# EAGLE design Shuttle (EAGLE 8.3.1)
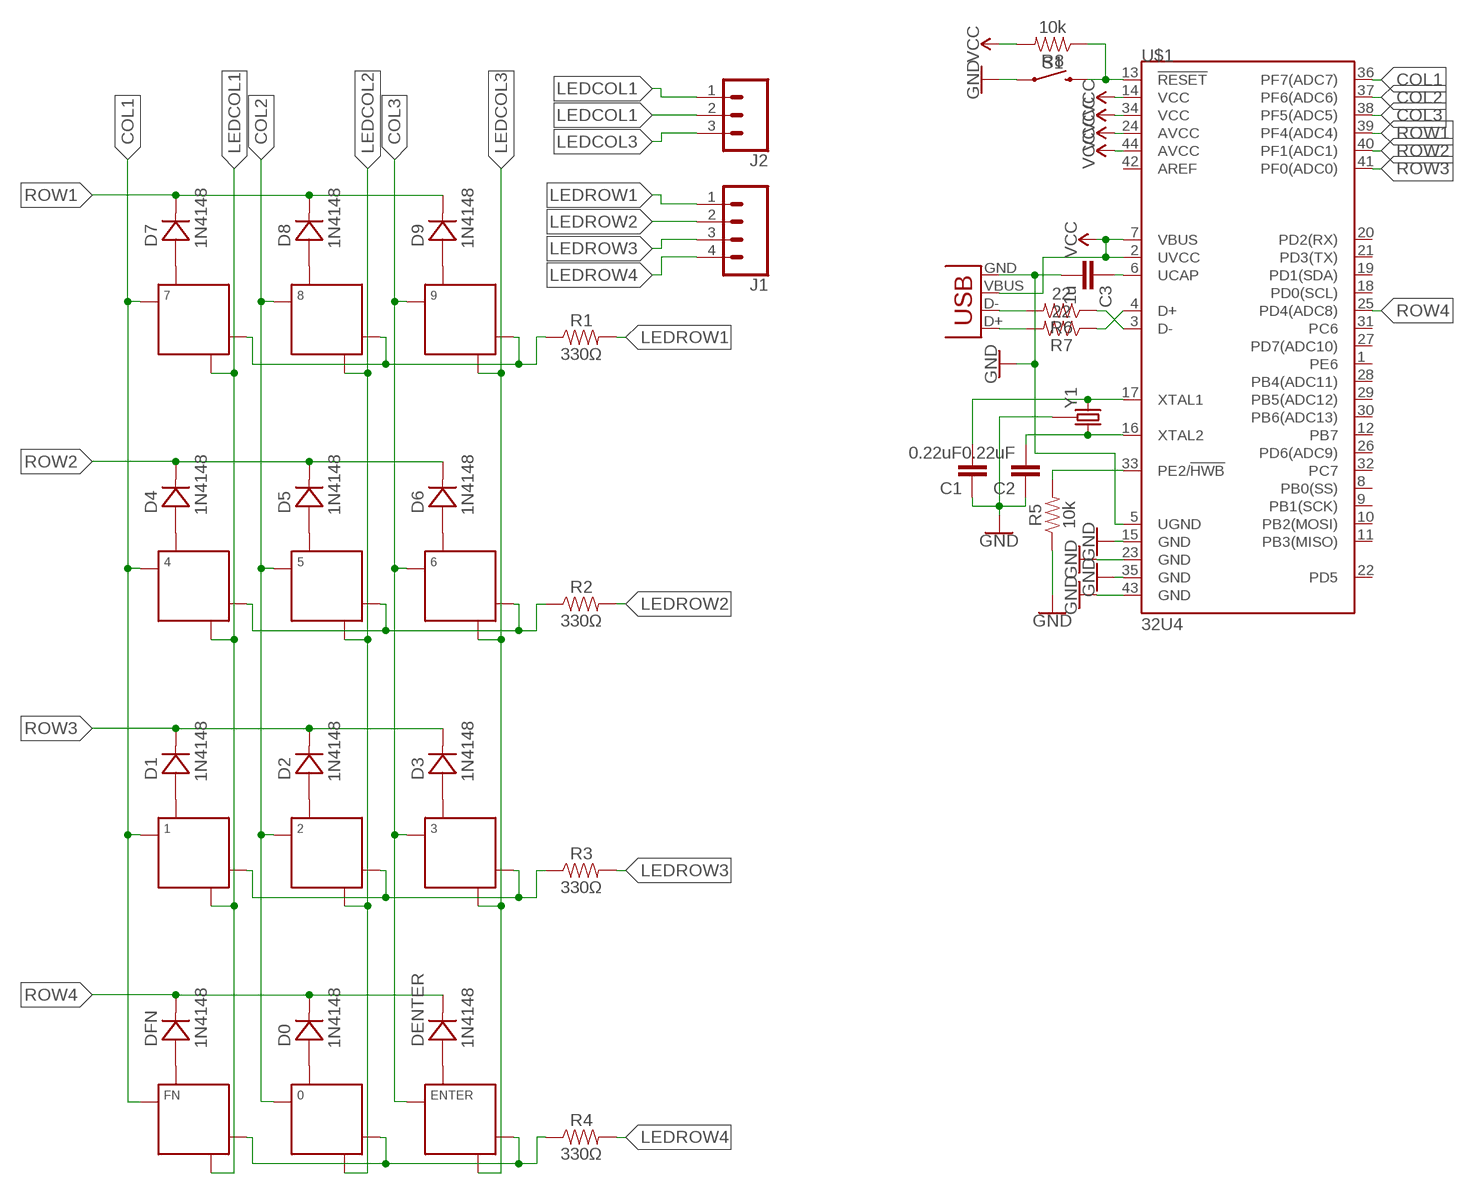
[diagram p0: schematic, sheet 1]

## Parts
0  KEYSWITCH-LED-ALPSMX-1U-LED  [ALPSMX-1U-LED]
1  KEYSWITCH-LED-ALPSMX-1U-LED  [ALPSMX-1U-LED]
2  KEYSWITCH-LED-ALPSMX-1U-LED  [ALPSMX-1U-LED]
3  KEYSWITCH-LED-ALPSMX-1U-LED  [ALPSMX-1U-LED]
4  KEYSWITCH-LED-ALPSMX-1U-LED  [ALPSMX-1U-LED]
5  KEYSWITCH-LED-ALPSMX-1U-LED  [ALPSMX-1U-LED]
6  KEYSWITCH-LED-ALPSMX-1U-LED  [ALPSMX-1U-LED]
7  KEYSWITCH-LED-ALPSMX-1U-LED  [ALPSMX-1U-LED]
8  KEYSWITCH-LED-ALPSMX-1U-LED  [ALPSMX-1U-LED]
9  KEYSWITCH-LED-ALPSMX-1U-LED  [ALPSMX-1U-LED]
C1  0.22uF  0.22UF-0603-25V-10%  [0603]
C2  0.22uF  0.22UF-0603-25V-10%  [0603]
C3  1u  0.22UF-0603-25V-10%  [0603]
D0  1N4148  DIODE-DO-35  [DO-35]
D1  1N4148  DIODE-DO-35  [DO-35]
D2  1N4148  DIODE-DO-35  [DO-35]
D3  1N4148  DIODE-DO-35  [DO-35]
D4  1N4148  DIODE-DO-35  [DO-35]
D5  1N4148  DIODE-DO-35  [DO-35]
D6  1N4148  DIODE-DO-35  [DO-35]
D7  1N4148  DIODE-DO-35  [DO-35]
D8  1N4148  DIODE-DO-35  [DO-35]
D9  1N4148  DIODE-DO-35  [DO-35]
DENTER  1N4148  DIODE-DO-35  [DO-35]
DFN  1N4148  DIODE-DO-35  [DO-35]
ENTER  KEYSWITCH-LED-ALPSMX-1U-LED  [ALPSMX-1U-LED]
FN  KEYSWITCH-LED-ALPSMX-1U-LED  [ALPSMX-1U-LED]
J1  CONN_04  [1X04]
J2  CONN_03  [1X03]
R1  330Ω  RESISTORAXIAL-0.3  [AXIAL-0.3]
R2  330Ω  RESISTORAXIAL-0.3  [AXIAL-0.3]
R3  330Ω  RESISTORAXIAL-0.3  [AXIAL-0.3]
R4  330Ω  RESISTORAXIAL-0.3  [AXIAL-0.3]
R5  10k  RESISTORAXIAL-0.3  [AXIAL-0.3]
R6  22  RESISTORAXIAL-0.3  [AXIAL-0.3]
R7  22  RESISTORAXIAL-0.3  [AXIAL-0.3]
R8  10k  RESISTORAXIAL-0.3  [AXIAL-0.3]
S1  MOMENTARY-SWITCH-SPST-PTH-6.0MM  [TACTILE_SWITCH_PTH_6.0MM]
U$1  32U4  ATMEGA32U4TQFP-44  [TQFP44]
X1  USB-MB-H  [USB-MB-H]
Y1  CRYSTAL-GROUNDEDSMD-5X3.2  [CRYSTAL-SMD-5X3.2-4PAD]

## Nets
COL1: 1.ALPS1(P0) 1.MX1(P0) 4.ALPS1(P0) 4.MX1(P0) 7.ALPS1(P0) 7.MX1(P0) FN.ALPS1(P0) FN.MX1(P0) U$1.36(PF7(ADC7))
COL2: 0.ALPS1(P0) 0.MX1(P0) 2.ALPS1(P0) 2.MX1(P0) 5.ALPS1(P0) 5.MX1(P0) 8.ALPS1(P0) 8.MX1(P0) U$1.37(PF6(ADC6))
COL3: 3.ALPS1(P0) 3.MX1(P0) 6.ALPS1(P0) 6.MX1(P0) 9.ALPS1(P0) 9.MX1(P0) ENTER.ALPS1(P0) ENTER.MX1(P0) U$1.38(PF5(ADC5))
GND: C1.1 C2.1 C3.2 R5.P$1 S1.1 U$1.5(UGND) U$1.15(GND) U$1.23(GND) U$1.35(GND) U$1.43(GND) X1.GND Y1.2 Y1.4
LEDCOL1: 1.LED+ 4.LED+ 7.LED+ FN.LED+ J2.1 J2.2
LEDCOL2: 0.LED+ 2.LED+ 5.LED+ 8.LED+
LEDCOL3: 3.LED+ 6.LED+ 9.LED+ ENTER.LED+ J2.3
LEDROW1: J1.1 R1.P$2
LEDROW2: J1.2 R2.P$2
LEDROW3: J1.3 R3.P$2
LEDROW4: J1.4 R4.P$2
N$1: 7.ALPS2(P1) 7.MX2(P1) D7.A
N$2: 8.ALPS2(P1) 8.MX2(P1) D8.A
N$3: 9.ALPS2(P1) 9.MX2(P1) D9.A
N$4: 4.ALPS2(P1) 4.MX2(P1) D4.A
N$5: 5.ALPS2(P1) 5.MX2(P1) D5.A
N$6: 6.ALPS2(P1) 6.MX2(P1) D6.A
N$7: 1.ALPS2(P1) 1.MX2(P1) D1.A
N$8: 2.ALPS2(P1) 2.MX2(P1) D2.A
N$9: 3.ALPS2(P1) 3.MX2(P1) D3.A
N$10: DFN.A FN.ALPS2(P1) FN.MX2(P1)
N$11: 0.ALPS2(P1) 0.MX2(P1) D0.A
N$12: DENTER.A ENTER.ALPS2(P1) ENTER.MX2(P1)
N$13: C2.2 U$1.16(XTAL2) Y1.1
N$14: 7.LED- 8.LED- 9.LED- R1.P$1
N$15: R7.P$2 X1.D+
N$16: R7.P$1 U$1.4(D+)
N$17: C1.2 U$1.17(XTAL1) Y1.3
N$18: 4.LED- 5.LED- 6.LED- R2.P$1
N$19: R5.P$2 U$1.33(PE2/!HWB)
N$20: R6.P$2 X1.D-
N$21: R6.P$1 U$1.3(D-)
N$23: C3.1 U$1.6(UCAP)
N$25: R8.P$1 S1.3 U$1.13(!RESET)
N$27: 1.LED- 2.LED- 3.LED- R3.P$1
N$28: 0.LED- ENTER.LED- FN.LED- R4.P$1
ROW1: D7.C D8.C D9.C U$1.39(PF4(ADC4))
ROW2: D4.C D5.C D6.C U$1.40(PF1(ADC1))
ROW3: D1.C D2.C D3.C U$1.41(PF0(ADC0))
ROW4: D0.C DENTER.C DFN.C U$1.25(PD4(ADC8))
VCC: R8.P$2 U$1.2(UVCC) U$1.7(VBUS) U$1.14(VCC) U$1.24(AVCC) U$1.34(VCC) U$1.44(AVCC) X1.VBUS
Unconnected: U$1.1(PE6) U$1.8(PB0(SS)) U$1.9(PB1(SCK)) U$1.10(PB2(MOSI)) U$1.11(PB3(MISO)) U$1.12(PB7) U$1.18(PD0(SCL)) U$1.19(PD1(SDA)) U$1.20(PD2(RX)) U$1.21(PD3(TX)) U$1.22(PD5) U$1.26(PD6(ADC9)) U$1.27(PD7(ADC10)) U$1.28(PB4(ADC11)) U$1.29(PB5(ADC12)) U$1.30(PB6(ADC13)) U$1.31(PC6) U$1.32(PC7) U$1.42(AREF)

## Library data of the parts
0 1-9 ENTER FN = Keyboard:KEYSWITCH-LED
C1 C2 = SparkFun-Capacitors:0.22UF: 0.22µF ceramic capacitors A capacitor is a passive two-terminal electrical component used to store electrical energy temporarily in an electric field.; PROD_ID: CAP-07822
C3 = SparkFun-Capacitors:0.22UF: 0.22µF ceramic capacitors A capacitor is a passive two-terminal electrical component used to store electrical energy temporarily in an electric field.; PROD_ID: CAP-07822; VALUE: 0.22uF
D0 D1-D9 DENTER DFN = Controller:DIODE: Standard 1N4148 diode
J1 = SparkFun-Connectors:CONN_04: Multi connection point. Often used as Generic Header-pin footprint for 0.1 inch spaced/style header connections On any of the 0.1 inch spaced packages, you can populate with these: Break Away Headers - Straight <https://www.sparkfun.com/products/116> (PRT-00116) Break Away Male Headers - Right Angle <https://www.sparkfun.com/products/553> (PRT-00553) Female Headers <https://www.sparkfun.com/products/115> (PRT-00115) Break Away Headers - Machine Pin <https://www.sparkfun.com/products/117> (PRT-00117) Break Away Female Headers - Swiss Machine Pin <https://www.sparkfun.com/products/743> (PRT-00743) For SCREWTERMINALS and SPRING TERMINALS visit here: Screw Terimnals on SparkFun.com <https://www.sparkfun.com/search/results?term=Screw+Terminals> (5mm/3.5mm/2.54mm spacing) This device is also useful as a general connection point to wire up your design to another part of your project. Our various solder wires solder well into these plated through hole pads. Hook-Up Wire - Assortment (Stranded, 22 AWG) <https://www.sparkfun.com/products/11375> (PRT-11375) Hook-Up Wire - Assortment (Solid Core, 22 AWG) <https://www.sparkfun.com/products/11367> (PRT-11367) View the entire wire category on our website here <https://www.sparkfun.com/categories/141> Special notes: Molex polarized connector foot print use with SKU : PRT-08231 with associated crimp pins and housings. 1MM SMD Version SKU: PRT-10208; PROD_ID: CONN-09696
J2 = SparkFun-Connectors:CONN_03: Multi connection point. Often used as Generic Header-pin footprint for 0.1 inch spaced/style header connections On any of the 0.1 inch spaced packages, you can populate with these: Break Away Headers - Straight <https://www.sparkfun.com/products/116> (PRT-00116) Break Away Male Headers - Right Angle <https://www.sparkfun.com/products/553> (PRT-00553) Female Headers <https://www.sparkfun.com/products/115> (PRT-00115) Break Away Headers - Machine Pin <https://www.sparkfun.com/products/117> (PRT-00117) Break Away Female Headers - Swiss Machine Pin <https://www.sparkfun.com/products/743> (PRT-00743) Stackable Header - 3 Pin (Female, 0.1") <https://www.sparkfun.com/products/13875> (PRT-13875) For SCREWTERMINALS and SPRING TERMINALS visit here: Screw Terimnals on SparkFun.com <https://www.sparkfun.com/search/results?term=Screw+Terminals> (5mm/3.5mm/2.54mm spacing) This device is also useful as a general connection point to wire up your design to another part of your project. Our various solder wires solder well into these plated through hole pads. Hook-Up Wire - Assortment (Stranded, 22 AWG) <https://www.sparkfun.com/products/11375> (PRT-11375) Hook-Up Wire - Assortment (Solid Core, 22 AWG) <https://www.sparkfun.com/products/11367> (PRT-11367) View the entire wire category on our website here <https://www.sparkfun.com/categories/141> Special notes: Molex polarized connector foot print use with SKU : PRT-08232 with associated crimp pins and housings.; PROD_ID: XXX-00000; VALUE: 455-1750-1-ND
R1-R8 = SparkFun-Resistors:RESISTOR: Generic Resistor Package
S1 = SparkFun-Switches:MOMENTARY-SWITCH-SPST: Momentary Switch (Pushbutton) - SPST Normally-open (NO) SPST momentary switches (buttons, pushbuttons). Variants PTH-12MM - 12mm square, through-hole Momentary Pushbutton Switch - 12mm Square <https://www.sparkfun.com/products/9190> (COM-09190) PTH-6.0MM, PTH-6.0MM-KIT - 6.0mm square, through-hole Mini Pushbutton Switch <https://www.sparkfun.com/products/97> (COM-00097) KIT package intended for soldering kit's - only one side of pads' copper is exposed. PTH-RIGHT-ANGLE-KIT - Right-angle, through-hole Right Angle Tactile Button <https://www.sparkfun.com/products/10791> - Used on SparkFun BigTime Watch Kit <https://www.sparkfun.com/products/11734> SMD-12MM - 12mm square, surface-mount Tactile Button - SMD (12mm) <https://www.sparkfun.com/products/12993> (COM-12993) Used on SparkFun PicoBoard <https://www.sparkfun.com/products/11888> SMD-4.5MM - 4.5mm Square Trackball Switch Used on SparkFun Blackberry Trackballer Breakout <https://www.sparkfun.com/products/13169> SMD-4.6MMX2.8MM - 4.60mm x 2.80mm, surface mount Used on SparkFun SAMD21 Mini Breakout <https://www.sparkfun.com/products/13664> SMD-5.2MM, SMD-5.2-REDUNDANT - 5.2mm square, surface-mount Mini Pushbutton Switch - SMD <https://www.sparkfun.com/products/8720> (COM-08720) Used on Arduino Pro Mini <https://www.sparkfun.com/products/11114> REDUNDANT package connects both switch circuits together SMD-6.0X3.5MM - 6.0 x 3.5mm, surface mount Momentary Reset Switch SMD <https://www.sparkfun.com/products/8229> (COM-08229) SMD-6.2MM-TALL - 6.2mm square, surface mount Tactile Button - SMD (6mm) <https://www.sparkfun.com/products/12992> Used on SparkFun Digital Sandbox <https://www.sparkfun.com/products/12651> SMD-RIGHT-ANGLE - Right-angle, surface mount Used on SparkFun Block for Intel® Edison - Arduino <https://www.sparkfun.com/products/13036>; PROD_ID: SWCH-08441; SF_SKU: COM-00097
U$1 = SparkFun-IC-Microcontroller:ATMEGA32U4: Atmel MCU, 32KByte Atmel 44-pin 8-bit Microcontroller with 32KBytes of ISP Flash and USB Controller Datasheet <http://cdn.sparkfun.com/datasheets/Dev/Arduino/Boards/ATMega32U4.pdf> SparkFun Products LilyPad Arduino USB - ATmega32U4 Board <https://www.sparkfun.com/products/12049> (DEV-12049) Pro Micro - 5V/16MHz <https://www.sparkfun.com/products/12640> (DEV-12640) Pro Micro - 3.3V/8MHz <https://www.sparkfun.com/products/12587> (DEV-12587) Fio v3 - ATmega32U4 <https://www.sparkfun.com/products/11520> (DEV-11520) Qduino Mini <https://www.sparkfun.com/products/13614> (DEV-13614) Makey Makey - Standard Kit <https://www.sparkfun.com/products/11511> (WIG-11511) Makey Makey Deluxe Kit <https://www.sparkfun.com/products/11519> (WIG-11519); PROD_ID: IC-11161
X1 = usb:USB: USB Connectors USB-B-PTH is fully proven SKU : PRT-00139 USB-miniB is fully proven SKU : PRT-00587 USB-A-PCB is untested. USB-A-H is throughly reviewed, but untested. Spark Fun Electronics SKU : PRT-00437 USB-B-SMT is throughly reviewed, but untested. Needs silkscreen touching up. USB-A-S has not been used/tested USB-MB-H has not been used/tested
Y1 = SparkFun-Clocks:CRYSTAL-GROUNDED: Crystals w/ Ground Pin (Generic) These are passive quartz crystals, which can be used as a clock source for a microcontroller. Crystal's are usually two-terminal devices. A third terminal may be optionally connected to ground, as recommended by the manufaturer.

## Board
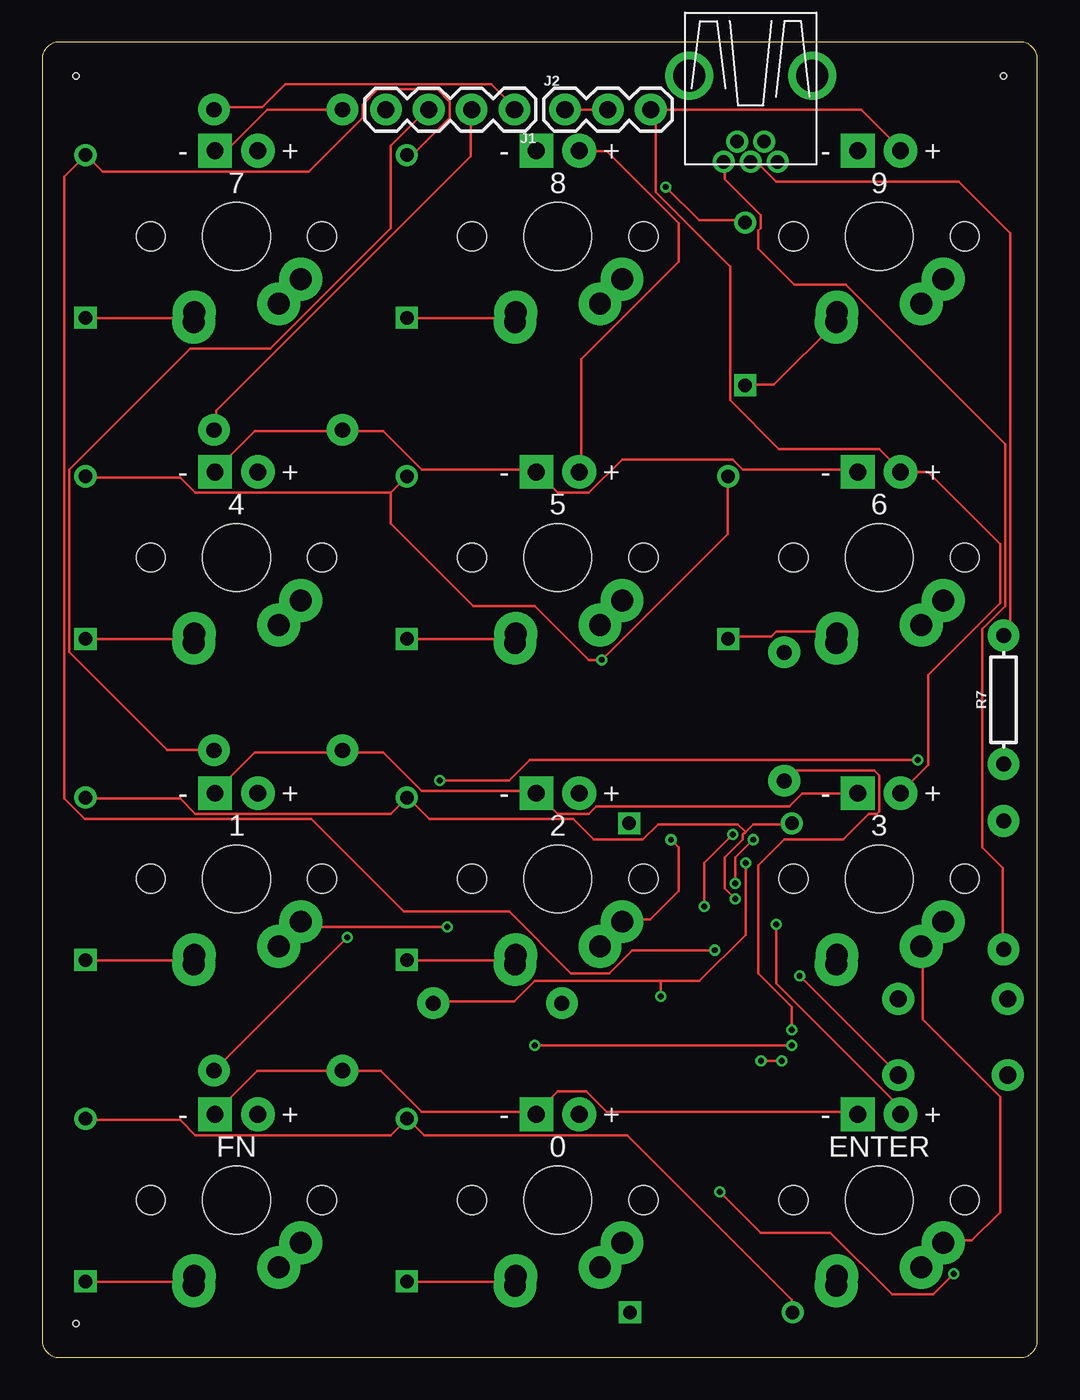
[diagram p1: board, top side]
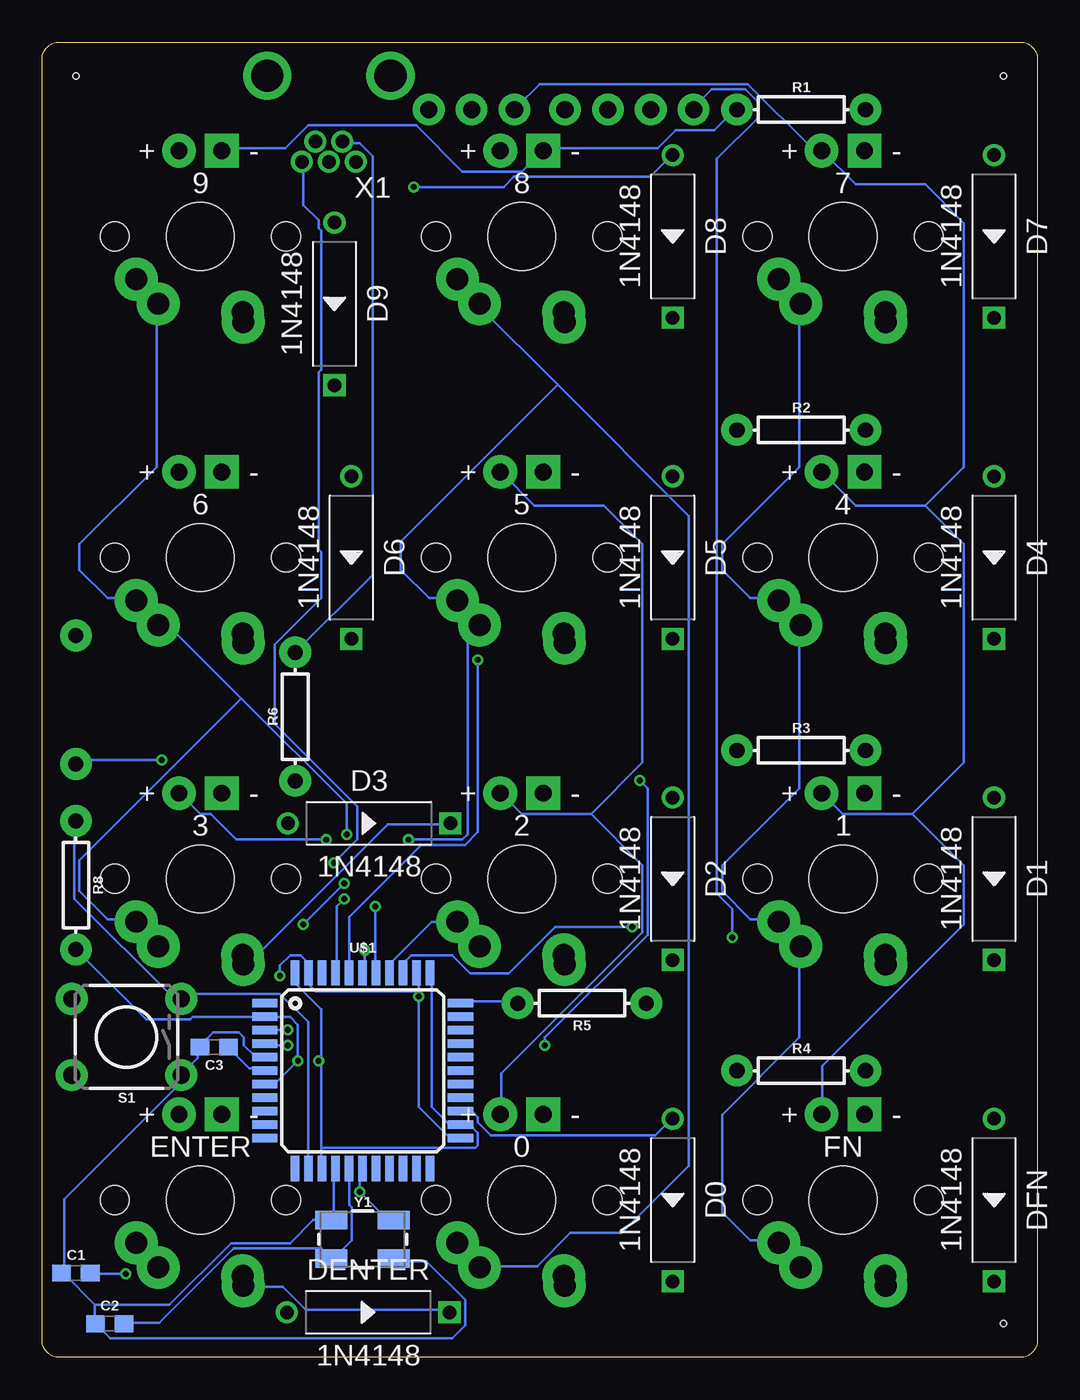
[diagram p2: board, bottom side, seen from below]

Size 59 x 78 mm. Coordinates in mm from the lower left corner, seen from the top.
Outline: 0,77 0,1 arc90 1,0 58,0 arc90 59,1 59,77 arc90 58,78 1,78 arc90 0,77
Copper layers (1*16): Top 0.035mm / dielectric 1.5mm / Bottom 0.035mm
Design rules "dirt_cheap_dirty_boards.v1": minimum track width 5mil, minimum drill 12mil, track to track 5mil, track to pad 5mil, pad to pad 5mil, via to via 5mil, smd to smd 0mil, copper to edge 10mil, drill to drill 10mil, minimum pad ring 10mil, minimum via ring 6mil, stop-mask expansion 2mil, vias tented up to drill 25mil, thermal gap 10mil
Holes 0.35 mm at 2,2 2,76 57,76

### Footprints (pad centres in the part's own frame; a part is rotated, then mirrored left to right if it is on the bottom)
ALPSMX-1U-LED = drill 1.3 pad 2.54: ALPS1 -2.5,4; ALPS2 2.5,4.5; MX1 -3.81,2.54; MX2 2.54,5.08 | drill 1 pad 2: LED+ -1.27,-5.08 | drill 1 pad 2 square: LED- 1.27,-5.08 | hole 4: 0,0 | hole 1.7: -5.08,0; 5.08,0
0603 = smd 1.1 x 1: 1 -0.85,0; 2 0.85,0
DO-35 = drill 0.8 square: A 4.82,0 | drill 0.8: C -4.82,0
1X04 = drill 1.016 pad 1.88: 1 0,0; 2 2.54,0; 3 5.08,0; 4 7.62,0
1X03 = drill 1.016 pad 1.88: 1 0,0; 2 2.54,0; 3 5.08,0
AXIAL-0.3 = drill 0.9 pad 1.88: P$1 -3.81,0; P$2 3.81,0
TACTILE_SWITCH_PTH_6.0MM = drill 1.016 pad 1.88: 1 -3.251,2.261; 2 3.251,2.261; 3 -3.251,-2.261; 4 3.251,-2.261
TQFP44 = smd 1.5 x 0.5: 1 -5.8,4; 2 -5.8,3.2; 3 -5.8,2.4; 4 -5.8,1.6; 5 -5.8,0.8; 6 -5.8,0; 7 -5.8,-0.8; 8 -5.8,-1.6; 9 -5.8,-2.4; 10 -5.8,-3.2; 11 -5.8,-4; 23 5.8,-4; 24 5.8,-3.2; 25 5.8,-2.4; 26 5.8,-1.6; 27 5.8,-0.8; 28 5.8,0; 29 5.8,0.8; 30 5.8,1.6; 31 5.8,2.4; 32 5.8,3.2; 33 5.8,4 | smd 0.5 x 1.5: 12 -4,-5.8; 13 -3.2,-5.8; 14 -2.4,-5.8; 15 -1.6,-5.8; 16 -0.8,-5.8; 17 0,-5.8; 18 0.8,-5.8; 19 1.6,-5.8; 20 2.4,-5.8; 21 3.2,-5.8; 22 4,-5.8; 34 4,5.8; 35 3.2,5.8; 36 2.4,5.8; 37 1.6,5.8; 38 0.8,5.8; 39 0,5.8; 40 -0.8,5.8; 41 -1.6,5.8; 42 -2.4,5.8; 43 -3.2,5.8; 44 -4,5.8
USB-MB-H = drill 0.8: D+ 5.1,0; D- 3.9,0.8; GND 5.1,-1.6; ID 3.9,-0.8; VBUS 5.1,1.6 | drill 1.9: P$6 0,-3.65; P$7 0,3.65
CRYSTAL-SMD-5X3.2-4PAD = smd 1.9 x 1.1: 1 -1.85,-1.15; 2 1.85,-1.15; 3 1.85,1.15; 4 -1.85,1.15

### Placement (x,y rotation side)
0  30.57,9.33 180 top
1  11.52,28.38 180 top
2  30.57,28.38 180 top
3  49.62,28.38 180 top
4  11.52,47.43 180 top
5  30.57,47.43 180 top
6  49.62,47.43 180 top
7  11.52,66.48 180 top
8  30.57,66.48 180 top
9  49.62,66.48 180 top
C1  57,5 0 bottom
C2  55,2 0 bottom
C3  48.8,18.4 180 bottom
D0  21.62,9.33 270 bottom
D1  2.57,28.38 270 bottom
D2  21.62,28.38 270 bottom
D3  39.62,31.67 0 bottom
D4  2.57,47.43 270 bottom
D5  21.62,47.43 270 bottom
D6  40.67,47.43 270 bottom
D7  2.57,66.48 270 bottom
D8  21.62,66.48 270 bottom
D9  41.67,62.48 270 bottom
DENTER  39.67,2.67 0 bottom
DFN  2.57,9.33 270 bottom
ENTER  49.62,9.33 180 top
FN  11.52,9.33 180 top
J1  28,74 180 top
J2  31,74 0 top
R1  14,74 0 bottom
R2  14,55 0 bottom
R3  14,36 0 bottom
R4  14,17 0 bottom
R5  27,21 180 bottom
R6  44,38 90 bottom
R7  57,39 90 top
R8  57,28 270 bottom
S1  54,19 180 bottom
U$1  40,17 0 bottom
X1  42,76 270 bottom
Y1  40,7 0 bottom

### Tracks (layer width: path | path; a pad name or v marks a point on that pad's centre or on a via)
COL1  (via drill 0.35)
  Top 0.152: 7.ALPS1 14.12,62.55 14.12,62.86 15.18,63.92 7.MX1 | 4.ALPS1 14.12,43.5 14.12,43.81 15.18,44.87 4.MX1 | FN.ALPS1 14.12,5.4 14.12,5.71 15.18,6.77 FN.MX1 | v24.02,25.52 15.64,25.52 15.34,25.82 1.MX1 15.18,25.82 14.12,24.76 14.12,24.45 1.ALPS1
  Bottom 0.152: v24.02,25.52 28.59,25.52 31.34,22.78 33.62,22.78 34.69,23.84 37.13,23.84 37.59,23.39 37.59,22.93 U$1.36 | FN.MX1 15.34,6.93 17.01,6.93 18.69,8.6 18.69,14.39 14.12,18.97 14.12,24.3 1.ALPS1 | 4.ALPS1 14.12,43.35 14.12,33.75 18.69,29.18 18.69,27.65 17.01,25.98 15.34,25.98 1.MX1 | 7.ALPS1 14.12,62.4 14.12,52.8 18.69,48.23 18.69,46.7 17.01,45.03 15.34,45.03 4.MX1
COL2  (via drill 0.35)
  Top 0.152: 2.ALPS1 33.17,24.45 33.17,24.76 34.23,25.82 2.MX1 34.39,25.98 36.06,25.98 37.74,27.65 37.74,30.24 v37.28,30.7 | 5.ALPS1 33.17,43.5 33.17,43.81 34.23,44.87 5.MX1 | 0.ALPS1 33.17,5.4 33.17,5.71 34.23,6.77 0.MX1 | 8.ALPS1 33.17,62.55 33.17,62.86 34.23,63.92 8.MX1
  Bottom 0.152: U$1.37 38.35,22.93 38.35,23.39 35.91,25.82 34.39,25.82 2.MX1 | 28.44,57.68 33.17,62.4 8.ALPS1 | 28.44,57.68 20.67,49.9 20.67,11.35 24.63,7.38 27.68,7.38 29.66,5.4 33.01,5.4 0.ALPS1 | 28.44,57.68 37.74,48.38 37.74,46.7 36.06,45.03 34.39,45.03 5.MX1 | v37.28,30.7 34.08,30.7 33.78,31.01 33.78,42.74 33.17,43.35 5.ALPS1
COL3  (via drill 0.35)
  Top 0.152: ENTER.ALPS1 52.22,5.4 52.22,5.71 53.28,6.77 ENTER.MX1 53.44,6.93 55.11,6.93 56.79,8.6 56.79,15.46 52.22,20.03 52.22,24.3 3.ALPS1 52.22,24.45 52.22,24.76 53.28,25.82 3.MX1 | 9.ALPS1 52.22,62.55 52.22,62.86 53.28,63.92 9.MX1 | v39.26,26.74 39.26,29.33 v40.94,31.01 | 6.MX1 53.28,44.87 53.28,44.57 52.22,43.5 6.ALPS1
  Bottom 0.152: v39.26,26.74 39.26,22.93 U$1.38 | v40.94,31.01 40.94,32.84 47.19,39.08 | 47.19,39.08 51.45,43.35 52.06,43.35 6.ALPS1 | 9.ALPS1 52.22,62.4 52.22,52.8 56.79,48.23 56.79,46.7 55.11,45.03 53.44,45.03 6.MX1 | 47.19,39.08 56.79,29.48 56.79,27.65 55.11,25.98 53.44,25.98 3.MX1
GND  (via drill 0.35)
  Top 0.152: v41.7,29.33 41.7,25.06 38.96,22.32 36.67,22.32 | 36.67,22.32 29.2,22.32 27.98,21.1 23.26,21.1 R5.P$1 | 36.67,22.32 v36.67,21.41 | v44.9,22.62 50.69,16.83 S1.1
  Bottom 0.152: U$1.5 45.82,17.9 46.43,17.9 47.03,18.51 47.03,18.97 47.34,19.27 48.86,19.27 49.63,18.51 C3.2 49.78,18.36 49.78,17.75 50.69,16.83 S1.1 50.84,16.68 50.84,16.22 57.7,9.36 57.7,5.1 C1.1 57.7,4.95 55.87,3.12 | U$1.15 41.7,11.19 41.7,8.3 Y1.4 42.92,8.15 44.29,6.77 47.8,6.77 51.45,3.12 55.87,3.12 | 55.87,3.12 55.87,2.05 C2.1 55.72,1.9 54.96,1.14 34.69,1.14 33.93,1.9 33.93,3.42 36.22,5.71 38.04,5.71 Y1.2 | 36.67,21.71 36.67,22.78 U$1.35 | 36.67,21.71 v36.67,21.41 36.67,14.85 34.84,13.02 34.23,13.02 U$1.23 | 36.67,21.71 42.77,21.71 43.07,22.01 43.07,22.78 U$1.43 43.23,22.93 43.23,23.39 43.68,23.84 44.29,23.84 44.9,23.23 v44.9,22.62 | v41.7,29.33 40.33,30.7 40.33,32.68 45.21,37.56 45.21,42.28 42.46,45.03 42.46,47.77 42.62,47.92 42.62,58.44 42.46,58.59 42.46,66.82 42.62,66.97 42.62,67.43 43.53,68.34 43.53,70.78 X1.GND
LEDCOL1
  Top 0.152: J2.1 31.03,73.98 33.47,73.98 J2.2
  Bottom 0.152: J2.1 30.88,74.14 29.51,75.51 17.16,75.51 13.36,71.7 12.9,71.7 7.LED+ 12.75,71.54 10.76,69.56 6.65,69.56 4.36,67.28 4.36,52.8 6.65,50.51 | 7.41,32.23 4.36,29.18 4.36,25.67 12.75,17.29 12.75,14.55 FN.LED+ | 7.41,32.23 11.53,32.23 12.75,33.44 1.LED+ | 6.65,50.51 10.76,50.51 12.75,52.49 4.LED+ | 6.65,50.51 4.36,48.23 4.36,35.27 7.41,32.23
LEDCOL2
  Top 0.152: 5.LED+ 31.95,52.65 31.95,59.2 37.74,64.99 37.74,67.28 33.47,71.54 31.95,71.54 8.LED+
  Bottom 0.152: 26.46,32.23 23.41,29.18 23.41,25.22 31.8,16.83 31.8,14.55 0.LED+ | 26.46,32.23 30.58,32.23 31.8,33.44 2.LED+ | 26.46,32.23 23.41,35.27 23.41,48.23 25.7,50.51 29.81,50.51 31.8,52.49 5.LED+
LEDCOL3  (via drill 0.35)
  Top 0.152: 36.37,73.98 48.56,73.98 50.84,71.7 9.LED+ | 36.37,73.98 36.22,73.98 J2.3 36.37,73.98 | v43.53,25.67 43.53,22.17 50.84,14.85 50.84,14.55 ENTER.LED+ | v41.09,28.11 41.09,29.63 v42.16,30.7 | 3.LED+ 51,33.6 52.52,35.12 52.52,40.45 56.79,44.72 56.79,48.23 52.52,52.49 51,52.49 6.LED+ 50.84,52.65 49.63,53.87 43.68,53.87 40.79,56.76 40.79,64.69 36.37,69.11 36.37,73.98
  Bottom 0.152: v41.09,28.11 v43.53,25.67 | v42.16,30.7 47.49,30.7 49.02,32.23 49.63,32.23 50.84,33.44 3.LED+
LEDROW1
  Top 0.152: R1.P$2 10.31,74.14 13.05,74.14 14.42,75.51 26.61,75.51 27.98,74.14 J1.1
LEDROW2
  Top 0.152: R2.P$2 10.31,55.08 10.31,56.15 25.39,71.24 25.39,73.98 J1.2
LEDROW3
  Top 0.152: R3.P$2 10.15,36.03 7.41,36.03 1.62,41.83 1.62,52.65 8.78,59.81 13.51,59.81 20.67,66.97 20.67,71.85 22.8,73.98 J1.3
LEDROW4  (via drill 0.35)
  Top 0.152: v18.08,24.91 10.31,17.14 R4.P$2
  Bottom 0.152: v18.08,24.91 18.08,26.59 18.99,27.5 18.99,71.09 16.55,73.53 16.55,74.44 17.32,75.2 19.3,75.2 20.36,74.14 J1.4
N$1
  Top 0.152: 8.94,61.49 8.78,61.64 2.69,61.64 D7.A | 8.94,61.49 7.MX2 | 8.94,61.49 7.ALPS2
N$2
  Top 0.152: 27.98,61.49 27.83,61.64 21.74,61.64 D8.A | 27.98,61.49 8.MX2 | 27.98,61.49 8.ALPS2
N$3
  Top 0.152: D9.A 41.7,57.68 43.38,57.68 47.03,61.33 9.ALPS2 47.03,61.49 9.MX2
N$4
  Top 0.152: 8.94,42.44 8.78,42.59 2.69,42.59 D4.A | 8.94,42.44 4.MX2 | 8.94,42.44 4.ALPS2
N$5
  Top 0.152: 27.98,42.44 27.83,42.59 21.74,42.59 D5.A | 27.98,42.44 5.MX2 | 27.98,42.44 5.ALPS2
N$6
  Top 0.152: D6.A 40.79,42.74 43.23,42.74 43.53,43.05 47.03,43.05 6.ALPS2 47.03,42.89 47.03,42.44 6.MX2
N$7
  Top 0.152: 8.94,23.39 8.78,23.54 2.69,23.54 D1.A | 8.94,23.39 1.MX2 | 8.94,23.39 1.ALPS2
N$8
  Top 0.152: 27.98,23.39 27.83,23.54 21.74,23.54 D2.A | 27.98,23.39 2.MX2 | 27.98,23.39 2.ALPS2
N$9
  Top 0.152: 3.MX2 47.03,23.39 47.03,23.84 3.ALPS2
  Bottom 0.152: D3.A 34.84,31.62 38.5,31.62 46.12,24 47.03,24 3.ALPS2
N$10
  Top 0.152: 8.94,4.34 8.78,4.49 2.69,4.49 DFN.A | 8.94,4.34 FN.MX2 | 8.94,4.34 FN.ALPS2
N$11
  Top 0.152: 27.98,4.34 27.83,4.49 21.74,4.49 D0.A | 27.98,4.34 0.MX2 | 27.98,4.34 0.ALPS2
N$12
  Bottom 0.152: DENTER.A 35,2.81 43.38,2.81 44.75,4.18 47.03,4.18 ENTER.ALPS2 47.03,4.34 ENTER.MX2
N$13
  Bottom 0.152: C2.2 54.05,2.05 52.06,2.05 47.65,6.47 42.46,6.47 Y1.1 41.7,5.86 40.63,6.93 40.63,8.91 40.79,9.06 40.79,11.19 U$1.16
N$14
  Top 0.152: R1.P$1 17.77,73.98 13.36,73.98 11.07,71.7 10.31,71.7 7.LED-
  Bottom 0.152: R1.P$1 17.93,73.98 19.15,72.76 21.43,72.76 22.5,71.7 29.2,71.7 8.LED- 29.36,71.54 30.58,70.33 34.08,70.33 36.82,73.07 43.23,73.07 44.6,71.7 48.25,71.7 9.LED-
N$15
  Top 0.152: X1.D+ 42.01,70.78 42.46,70.78 43.53,69.72 54.35,69.72 57.4,66.67 57.4,43.2 57.09,42.89 R7.P$2
N$16  (via drill 0.35)
  Top 0.152: v29.2,18.51 v44.44,18.51 | v23.57,34.21 27.68,34.21 28.9,35.43 v51.91,35.43
  Bottom 0.152: v44.44,18.51 45.66,18.51 U$1.4 | v29.2,18.51 29.2,18.97 23.11,25.06 23.11,33.75 v23.57,34.21 | v51.91,35.43 56.79,35.43 56.94,35.27 R7.P$1
N$17  (via drill 0.35)
  Top 0.152: v54.05,4.95 52.83,3.73 50.39,3.73 46.73,7.38 42.62,7.38 v40.18,9.82
  Bottom 0.152: v54.05,4.95 56.03,4.95 C1.2 | U$1.17 40.02,11.19 40.18,11.04 v40.18,9.82 38.65,8.3 38.2,8.3 Y1.3
N$18
  Top 0.152: 4.LED- 10.31,52.65 12.59,54.93 17.77,54.93 R2.P$1 17.93,54.93 20.21,54.93 22.5,52.65 29.2,52.65 5.LED- 29.36,52.49 30.58,51.28 32.41,51.28 34.39,53.26 40.94,53.26 41.55,52.65 48.25,52.65 6.LED-
N$19
  Bottom 0.152: U$1.33 34.08,21.1 30.88,21.1 R5.P$2
N$20
  Bottom 0.152: X1.D- 41.09,72 40.18,72 39.41,71.24 39.41,46.4 43.99,41.83 R6.P$2
N$21  (via drill 0.35)
  Top 0.152: v44.44,19.42 44.44,20.8 42.46,22.78 42.46,29.18 43.99,30.7 47.49,30.7 49.02,32.23 49.47,32.23 49.63,32.38 49.63,34.51 49.32,34.82 44.75,34.82 44.14,34.21 R6.P$1
  Bottom 0.152: v44.44,19.42 45.66,19.42 U$1.3
N$23
  Bottom 0.152: C3.1 47.95,18.36 46.73,17.14 45.82,17.14 U$1.6
N$25
  Bottom 0.152: U$1.13 43.23,11.35 43.23,19.88 44.9,21.56 50.54,21.56 50.69,21.41 S1.3 50.84,21.41 51.3,21.41 57.09,27.2 57.09,31.77 R8.P$1
N$27
  Top 0.152: 1.LED- 10.31,33.6 12.59,35.88 17.77,35.88 R3.P$1 17.93,35.88 20.21,35.88 22.5,33.6 29.2,33.6 2.LED- 29.36,33.44 30.58,32.23 32.41,32.23 32.86,32.68 44.29,32.68 45.05,33.44 48.25,33.44 3.LED-
N$28
  Top 0.152: FN.LED- 10.31,14.55 12.75,16.98 17.77,16.98 R4.P$1 17.93,16.98 20.06,16.98 22.5,14.55 29.2,14.55 0.LED- 29.36,14.55 30.58,15.77 32.25,15.77 33.47,14.55 48.25,14.55 ENTER.LED-
ROW1  (via drill 0.35)
  Top 0.152: v39.87,24.15 35,24.15 33.62,22.78 31.34,22.78 27.68,26.43 21.43,26.43 15.95,31.92 2.53,31.92 1.32,33.14 1.32,70.02 2.53,71.24 D7.C 2.69,71.24 3.6,70.33 15.79,70.33 18.99,73.53 18.99,74.29 19.91,75.2 23.41,75.2 24.18,74.44 24.18,73.53 22.04,71.39 21.74,71.39 D8.C | v36.98,69.41 38.96,67.43 41.55,67.43 D9.C
  Bottom 0.152: v39.87,24.15 39.87,22.93 U$1.39 | v36.98,69.41 31.64,69.41 31.03,70.02 22.96,70.02 21.74,71.24 D8.C
ROW2  (via drill 0.35)
  Top 0.152: 20.67,51.28 9.09,51.28 8.17,52.19 2.69,52.19 D4.C | 20.67,51.28 21.58,52.19 D5.C | D6.C 40.63,52.19 40.63,48.84 v33.17,41.37 32.41,41.37 29.2,44.57 25.55,44.57 20.67,49.45 20.67,51.28
  Bottom 0.152: v33.17,41.37 33.17,31.16 33.93,30.4 36.52,30.4 40.79,26.13 40.79,22.93 U$1.40
ROW3  (via drill 0.35)
  Top 0.152: v41.09,27.2 40.48,27.81 40.48,29.63 41.55,30.7 41.55,31.01 41.7,31.16 | 41.7,31.16 42.16,31.62 44.29,31.62 D3.C | D1.C 2.69,33.14 8.17,33.14 9.09,32.23 20.67,32.23 21.58,33.14 D2.C 21.74,33.14 22.96,31.92 31.49,31.92 32.71,30.7 35.6,30.7 36.52,31.62 41.24,31.62 41.7,31.16
  Bottom 0.152: v41.09,27.2 41.55,26.74 41.55,22.93 U$1.41
ROW4
  Top 0.152: DENTER.C 44.44,2.81 44.44,3.42 34.69,13.18 22.65,13.18 21.74,14.09 D0.C 21.58,14.09 20.67,13.18 9.09,13.18 8.17,14.09 2.69,14.09 DFN.C
  Bottom 0.152: U$1.25 34.08,14.55 33.47,14.55 33.17,14.24 33.17,13.94 32.41,13.18 22.65,13.18 21.74,14.09 D0.C
VCC  (via drill 0.35)
  Top 0.152: X1.VBUS 40.48,70.78 40.48,69.87 42.62,67.73 42.62,66.97 42.46,66.82 42.46,65.75 44.6,63.62 47.65,63.62 57.09,54.17 57.09,44.57 55.72,43.2 55.72,30.24 56.94,29.02 56.94,24.3 R8.P$2 | v43.84,17.59 v42.62,17.59
  Bottom 0.152: U$1.34 35.91,22.78 35.91,14.85 35,13.94 34.23,13.94 U$1.24 34.08,13.79 33.62,13.79 33.17,13.33 33.17,12.57 33.32,12.41 42.46,12.41 | 42.46,17.59 42.46,20.64 43.99,22.17 43.99,22.78 U$1.44 | 42.46,17.59 42.46,12.41 | 42.46,12.41 42.46,11.35 U$1.14 | U$1.7 45.66,16.22 45.21,16.22 v43.84,17.59 43.84,19.73 44.29,20.19 45.66,20.19 U$1.2 45.82,20.19 50.08,20.19 50.24,20.03 52.83,20.03 56.94,24.15 R8.P$2 | v42.62,17.59 42.46,17.59